# EAGLE design LuvaAcel (EAGLE 6.6.0)
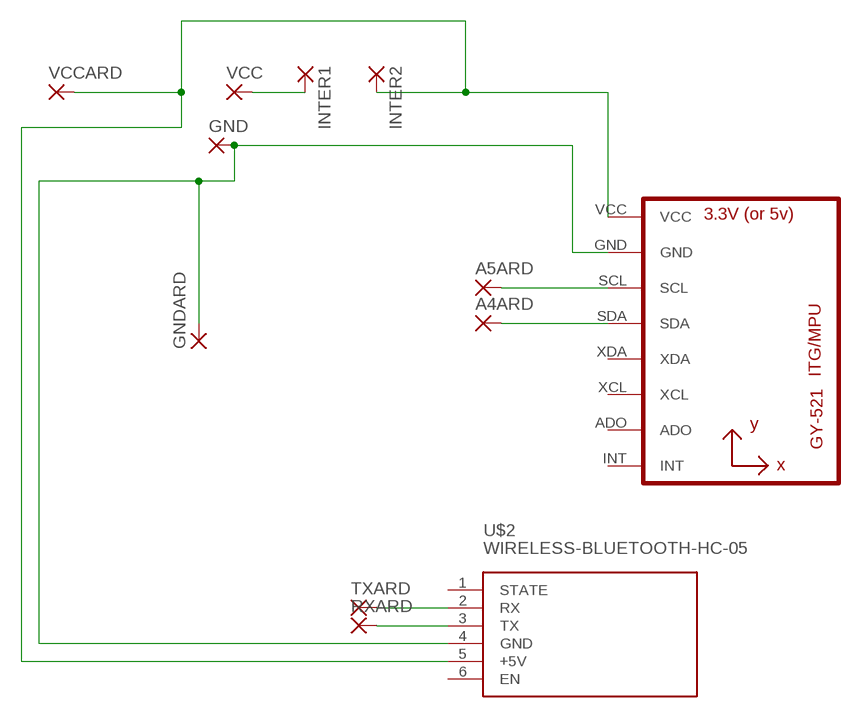
[diagram p0: schematic, sheet 1]

## Parts
A4ARD  3,17/1,1  [3,17/1,1]
A5ARD  3,17/1,1  [3,17/1,1]
GND  3,17/1,1  [3,17/1,1]
GNDARD  3,17/1,1  [3,17/1,1]
INTER1  3,17/1,1  [3,17/1,1]
INTER2  3,17/1,1  [3,17/1,1]
RXARD  3,17/1,1  [3,17/1,1]
TXARD  3,17/1,1  [3,17/1,1]
U1  GY-521MPU6050  [GY-521]
U$2  WIRELESS-BLUETOOTH-HC-05  [WIRELESS-BLUETOOTH-HC-05]
VCC  3,17/1,1  [3,17/1,1]
VCCARD  3,17/1,1  [3,17/1,1]

## Nets
N$1: A5ARD.1(P) U1.SCL
N$2: A4ARD.1(P) U1.SDA
N$4: GND.1(P) GNDARD.1(P) U1.GND U$2.4(GND)
N$5: TXARD.1(P) U$2.2(RX)
N$6: RXARD.1(P) U$2.3(TX)
N$7: INTER2.1(P) U1.VCC U$2.5(+5V) VCCARD.1(P)
N$8: INTER1.1(P) VCC.1(P)
Unconnected: U1.ADO U1.INT U1.XCL U1.XDA U$2.1(STATE) U$2.6(EN)

## Library data of the parts
A4ARD A5ARD GND GNDARD INTER1 INTER2 RXARD TXARD VCC VCCARD = wirepad:3,17/1,1: THROUGH-HOLE PAD
U1 = gy-521:GY-521
U$2 = diy-modules:WIRELESS-BLUETOOTH-HC-05: Bluetooth Transceiver Module based on HC-05 board Tutorial is available here: https://arduino-info.wikispaces.com/BlueTooth-HC05-HC06-Modules-How-To Click here to find device on ebay.com <http://www.ebay.com/sch/hc-05+module+rs232>

## Board
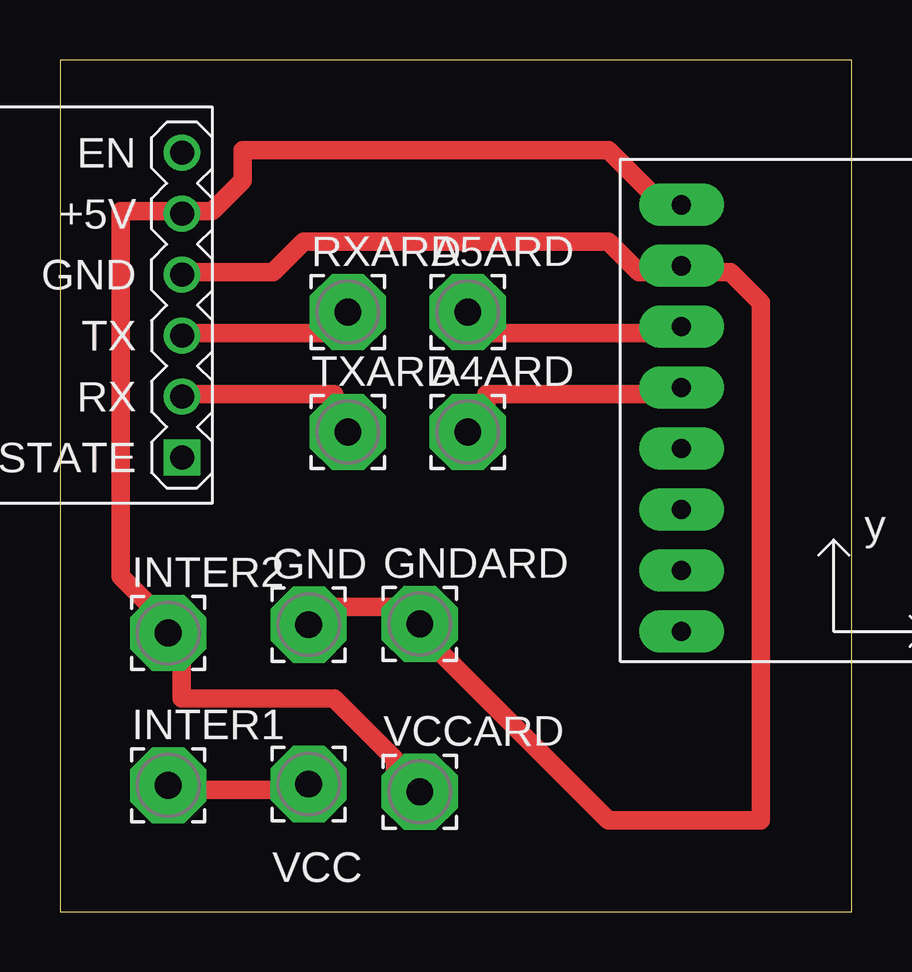
[diagram p1: board, top side]

Size 33 x 35.51 mm. Coordinates in mm from the lower left corner, seen from the top.
Outline: 0,0 33,0 33,35.51 0,35.51 0,0
Copper layers (1*16): Top 0.035mm / dielectric 1.5mm / Bottom 0.035mm
Design rules "default *": minimum track width 30mil, minimum drill 0.35mm, track to track 30mil, track to pad 30mil, pad to pad 24mil, via to via 30mil, smd to smd 30mil, copper to edge 40mil, drill to drill 6mil, minimum pad ring 10mil, minimum via ring 8mil, stop-mask expansion 4mil, vias tented up to drill 0mil, thermal gap 10mil

### Footprints (pad centres in the part's own frame; a part is rotated, then mirrored left to right if it is on the bottom)
3,17/1,1 = drill 1.118 pad 3.175 octagon: 1 0,0
GY-521 = drill 0.8 pad 1.778 long: ADO -8.89,-6.35; GND -8.89,6.35; INT -8.89,-8.89; SCL -8.89,3.81; SDA -8.89,1.27; VCC -8.89,8.89; XCL -8.89,-3.81; XDA -8.89,-1.27
WIRELESS-BLUETOOTH-HC-05 = drill 1 square: 1 -6.35,-17.145 | drill 1: 2 -3.81,-17.145; 3 -1.27,-17.145; 4 1.27,-17.145; 5 3.81,-17.145; 6 6.35,-17.145

### Placement (x,y rotation side)
A4ARD  17,20 0 top
A5ARD  17,25 0 top
GND  10.37,11.97 0 top
GNDARD  15,12 0 top
INTER1  4.51,5.27 0 top
INTER2  4.51,11.62 0 top
RXARD  12,25 0 top
TXARD  12,20 0 top
U1  34.8,20.58 0 top
U$2  -12.06,25.29 90 top
VCC  10.37,5.32 0 top
VCCARD  15,5 0 top

### Tracks (layer width: path | path; a pad name or v marks a point on that pad's centre or on a via)
N$1
  Top 0.762: U1.SCL 25.4,24.13 17.78,24.13 A5ARD.1
N$2
  Top 0.762: U1.SDA 25.4,21.59 17.78,21.59 17.78,20.32 A4ARD.1
N$4
  Top 0.762: GND.1 11.43,12.7 13.97,12.7 GNDARD.1 15.24,11.43 22.86,3.81 29.21,3.81 29.21,25.4 27.94,26.67 26.67,26.67 U1.GND 25.4,26.67 24.13,26.67 22.86,27.94 10.16,27.94 8.89,26.67 5.08,26.67 U$2.4
N$5
  Top 0.762: U$2.2 5.08,21.59 11.43,21.59 11.43,20.32 TXARD.1
N$6
  Top 0.762: U$2.3 5.08,24.13 11.43,24.13 RXARD.1
N$7
  Top 0.762: 5.08,29.21 2.54,29.21 2.54,13.97 3.81,12.7 INTER2.1 5.08,11.43 5.08,8.89 11.43,8.89 13.97,6.35 13.97,5.08 VCCARD.1 | 5.08,29.21 6.35,29.21 7.62,30.48 7.62,31.75 22.86,31.75 25.4,29.21 U1.VCC | 5.08,29.21 U$2.5
N$8
  Top 0.762: INTER1.1 5.08,5.08 10.16,5.08 VCC.1